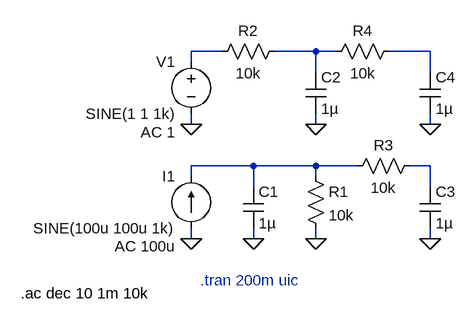
[diagram p0: schematic Draft1.asc]
Draft1.asc, the LTspice schematic file:
Version 4
SHEET 1 880 680
WIRE 128 -64 80 -64
WIRE 272 -64 208 -64
WIRE 304 -64 272 -64
WIRE 448 -64 384 -64
WIRE 80 -48 80 -64
WIRE 272 -32 272 -64
WIRE 448 -32 448 -64
WIRE 80 48 80 32
WIRE 272 48 272 32
WIRE 448 48 448 32
WIRE 176 112 80 112
WIRE 272 112 176 112
WIRE 336 112 272 112
WIRE 448 112 416 112
WIRE 80 128 80 112
WIRE 272 128 272 112
WIRE 176 144 176 112
WIRE 448 144 448 112
WIRE 80 224 80 208
WIRE 176 224 176 208
WIRE 272 224 272 208
WIRE 448 224 448 208
FLAG 80 224 0
FLAG 176 224 0
FLAG 272 224 0
FLAG 80 48 0
FLAG 272 48 0
FLAG 448 224 0
FLAG 448 48 0
SYMBOL current 80 208 R180
WINDOW 0 24 80 Left 2
WINDOW 3 24 0 Left 2
WINDOW 123 24 -28 Left 2
WINDOW 39 0 0 Left 0
SYMATTR InstName I1
SYMATTR Value SINE(100u 100u 1k)
SYMATTR Value2 AC 100u
SYMBOL cap 160 144 R0
SYMATTR InstName C1
SYMATTR Value 1µ
SYMBOL res 256 112 R0
SYMATTR InstName R1
SYMATTR Value 10k
SYMBOL cap 256 32 M180
WINDOW 0 24 56 Left 2
WINDOW 3 24 8 Left 2
SYMATTR InstName C2
SYMATTR Value 1µ
SYMBOL res 112 -48 R270
WINDOW 0 32 56 VTop 2
WINDOW 3 -2 56 VBottom 2
SYMATTR InstName R2
SYMATTR Value 10k
SYMBOL voltage 80 -64 M0
WINDOW 123 24 124 Left 2
WINDOW 39 0 0 Left 0
SYMATTR InstName V1
SYMATTR Value SINE(1 1 1k)
SYMATTR Value2 AC 1
SYMBOL res 320 128 R270
WINDOW 0 32 56 VTop 2
WINDOW 3 -2 56 VBottom 2
SYMATTR InstName R3
SYMATTR Value 10k
SYMBOL cap 432 144 R0
SYMATTR InstName C3
SYMATTR Value 1µ
SYMBOL cap 432 -32 R0
SYMATTR InstName C4
SYMATTR Value 1µ
SYMBOL res 288 -48 R270
WINDOW 0 32 56 VTop 2
WINDOW 3 -2 56 VBottom 2
SYMATTR InstName R4
SYMATTR Value 10k
TEXT 94 288 Left 2 ;.tran 200m uic
TEXT -182 308 Left 2 !.ac dec 10 1m 10k

The netlist it stands for:
* Draft1.asc
I1 0 N004 SINE(100u 100u 1k) AC 100u
C1 N004 0 1µ
R1 N004 0 10k
C2 0 N002 1µ
R2 N001 N002 10k
V1 N001 0 SINE(1 1 1k) AC 1
R3 N004 N005 10k
C3 N005 0 1µ
C4 N003 0 1µ
R4 N002 N003 10k
* .tran 200m uic
.ac dec 10 1m 10k
.backanno
.end